# EAGLE design SMD RGB COM AO3402 REV1 (EAGLE 8.5.1)
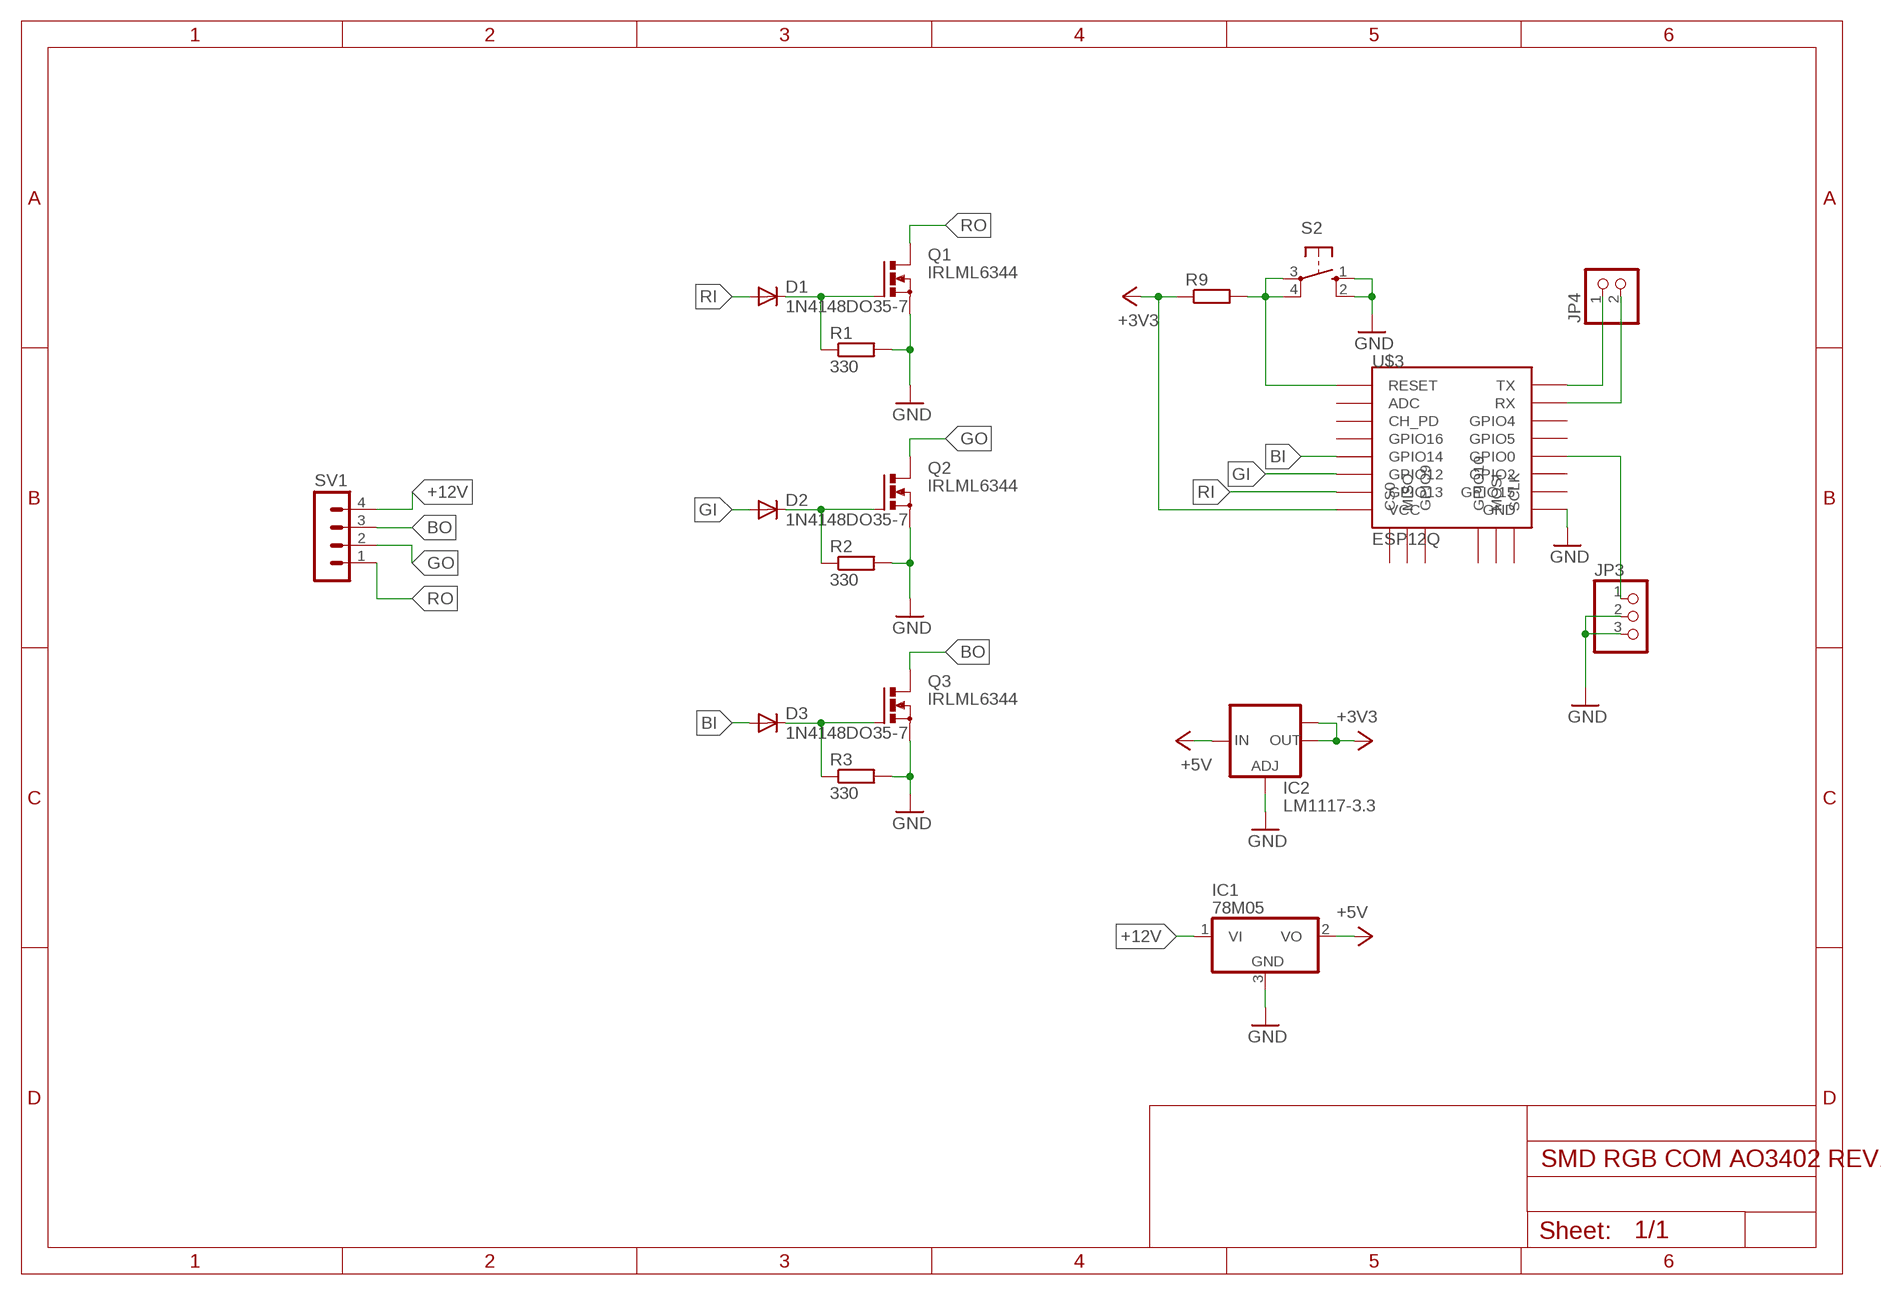
[diagram p0: schematic, sheet 1]

## Parts
D1  1N4148DO35-7  [DO35-7]
D2  1N4148DO35-7  [DO35-7]
D3  1N4148DO35-7  [DO35-7]
IC1  78M05  7805DT  [TO252]
IC2  LM1117-3.3  LM1117IMPX-ADJ  [SOT223]
JP3  PINHD-1X3  [1X03]
JP4  PINHD-1X2  [1X02]
Q1  IRLML6344  [SOT-23]
Q2  IRLML6344  [SOT-23]
Q3  IRLML6344  [SOT-23]
R1  330  R-EU_0204/7  [0204/7]
R2  330  R-EU_0204/7  [0204/7]
R3  330  R-EU_0204/7  [0204/7]
R9  R-EU_0204/7  [0204/7]
S2  10-XX  [B3F-10XX]
SV1  MA04-1  [MA04-1]
U$3  ESP12Q  [ESP12Q]

## Nets
+3V3: IC2.2(OUT) IC2.TAB(OUT1) R9.1 U$3.VCC
+5V [+V]: IC1.2(VO) IC2.3(IN)
+12V: IC1.1(VI) SV1.4
BB: D3.C Q3.P1(G) R3.1
BG: D2.C Q2.P1(G) R2.1
BI: D3.A U$3.GPIO14
BO [+V]: Q3.P3(D) SV1.3
BR: D1.C Q1.P1(G) R1.1
GI: D2.A U$3.GPIO12
GND [GND]: IC1.3(GND) IC2.1(ADJ) JP3.2 JP3.3 Q1.P2(S) Q2.P2(S) Q3.P2(S) R1.2 R2.2 R3.2 S2.1(S) S2.2(S1) U$3.GND
GO [+V]: Q2.P3(D) SV1.2
N$8: R9.2 S2.3(P) S2.4(P1) U$3.RESET
N$12: JP3.1 U$3.GPIO0
N$13: JP4.1 U$3.TX
N$14: JP4.2 U$3.RX
RI: D1.A U$3.GPIO13
RO [+V]: Q1.P3(D) SV1.1
Unconnected: U$3.ADC U$3.CH_PD U$3.CS0 U$3.GPIO2 U$3.GPIO4 U$3.GPIO5 U$3.GPIO9 U$3.GPIO10 U$3.GPIO15 U$3.GPIO16 U$3.MISO U$3.MOSI U$3.SCLK

## Library data of the parts
D1-D3 = diode:1N4148: DIODE high speed (Philips)
IC1 = linear:78*: Positive VOLTAGE REGULATOR Source: http://cache.national.com/ds/LM/LM78L05.pdf http://www.fairchildsemi.com/ds/LM/LM7805.pdf
IC2 = lm1117:LM1117IMPX-ADJ
JP3 = pinhead:PINHD-1X3: PIN HEADER
JP4 = pinhead:PINHD-1X2: PIN HEADER
Q1-Q3 = mosfet:IRLML6344: Nch MOSFET IRLML6344 30V 5A http://akizukidenshi.com/catalog/g/gI-06049/ I-06049
R1-R3 R9 = rcl:R-EU_: RESISTOR, European symbol; SPICEPREFIX: R
S2 = switch-omron:10-XX: OMRON SWITCH; MPN: B3F-1000; OC_FARNELL: 176432; OC_NEWARK: 36M3542
SV1 = con-lstb:MA04-1: PIN HEADER; OC_FARNELL: unknown; OC_NEWARK: unknown
U$3 = esp826612q:ESP12Q: ESP8266 Wifi module 12-Q

## Net classes
0 SIGNAL: width 0.61 mm, clearance 0.381 mm
1 GND: width 1.016 mm, clearance 0.254 mm
2 +V: width 1.016 mm, clearance 0.381 mm

## Board
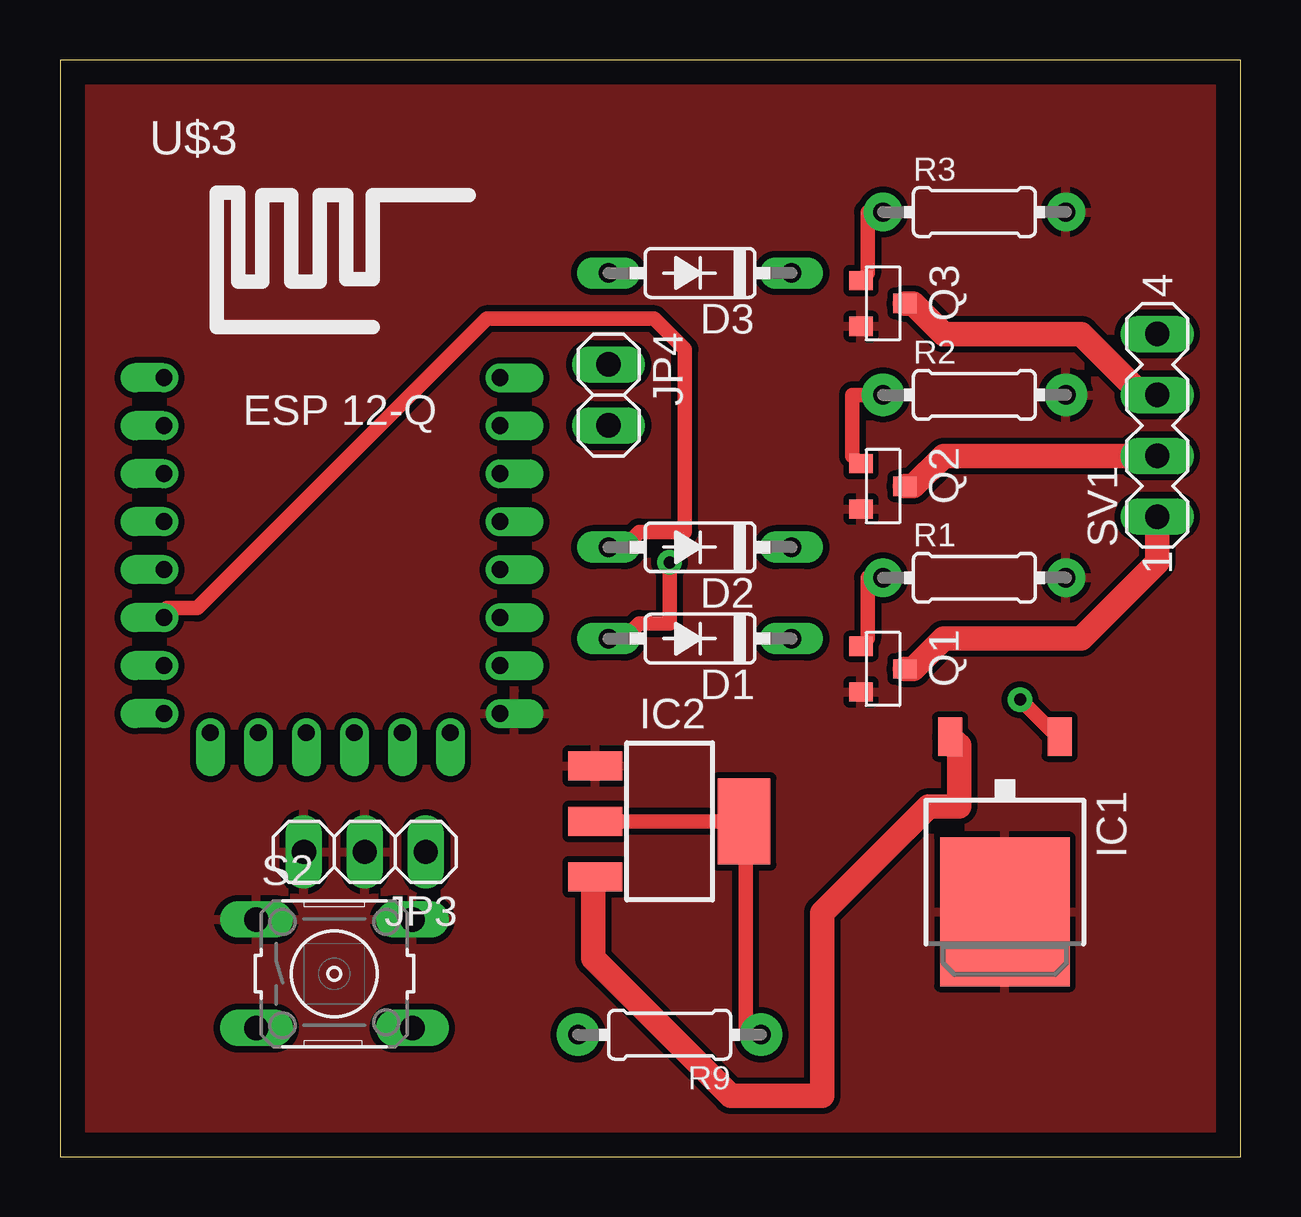
[diagram p1: board, top side]
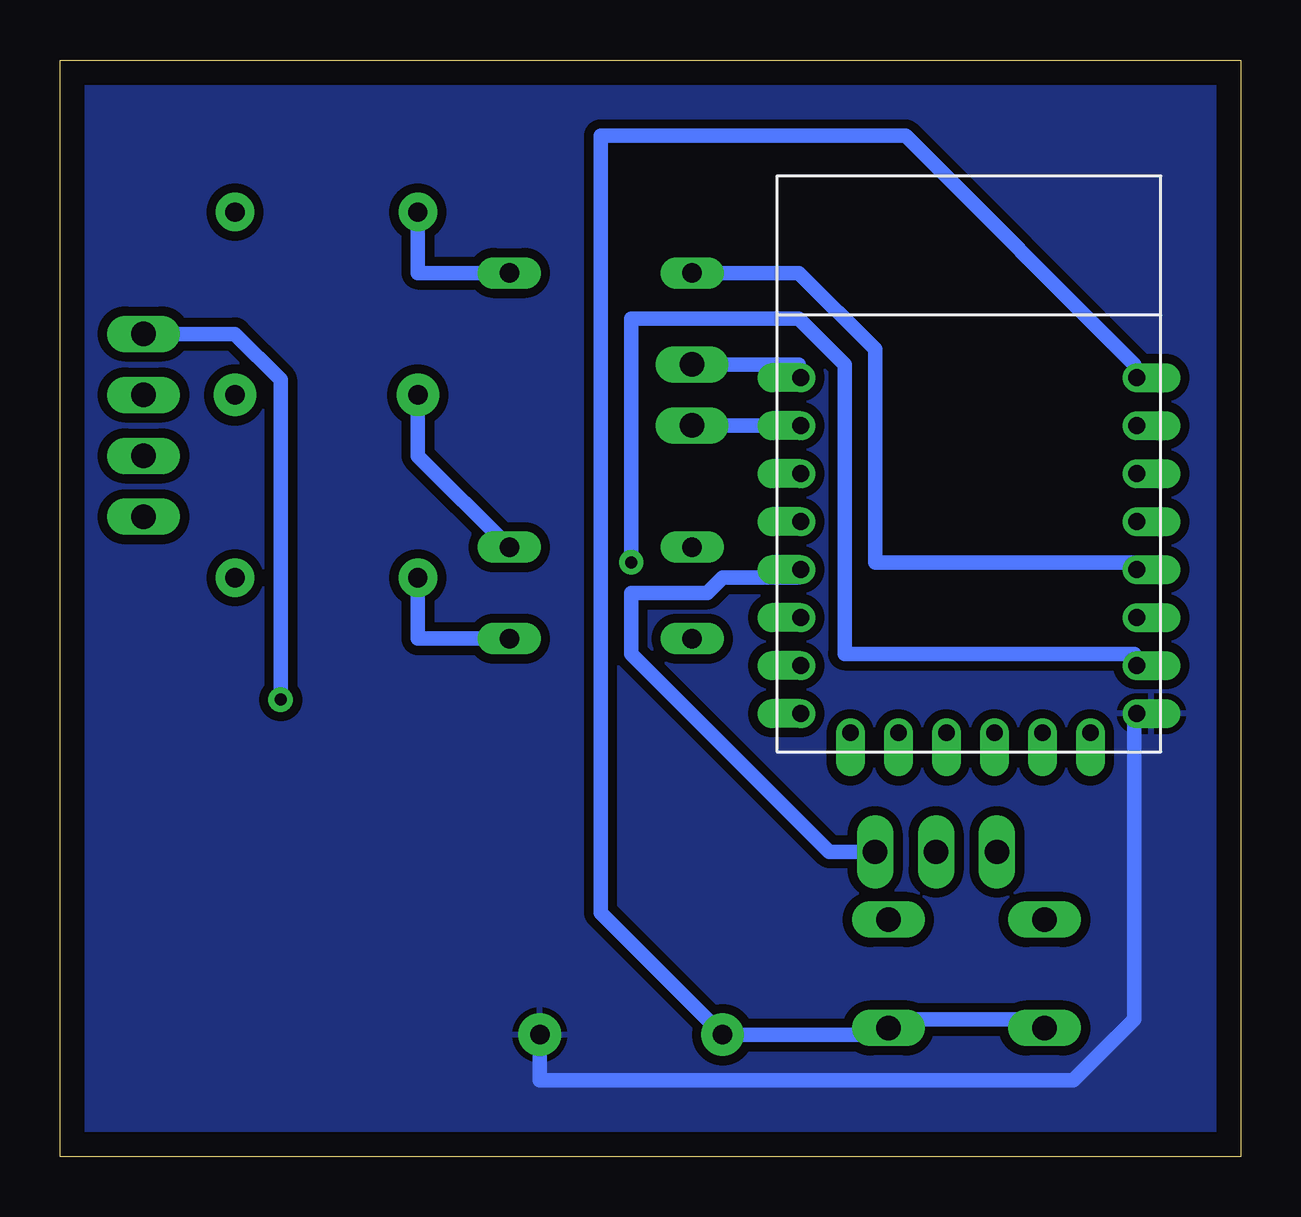
[diagram p2: board, bottom side, seen from below]

Size 49.2 x 45.71 mm. Coordinates in mm from the lower left corner, seen from the top.
Outline: 0,0 49.2,0 49.2,45.71 0,45.71 0,0
Copper layers (1*16): Top 0.035mm / dielectric 1.5mm / Bottom 0.035mm
Design rules "default": minimum track width 6mil, minimum drill 0.35mm, track to track 6mil, track to pad 6mil, pad to pad 6mil, via to via 6mil, smd to smd 6mil, copper to edge 40mil, drill to drill 6mil, minimum pad ring 10mil, minimum via ring 8mil, stop-mask expansion 4mil, vias tented up to drill 0mil, thermal gap 10mil

### Footprints (pad centres in the part's own frame; a part is rotated, then mirrored left to right if it is on the bottom)
DO35-7 = drill 0.813 long: A 3.81,0; C -3.81,0
TO252 = smd 1 x 1.6: 1 -2.28,-4.8; 2 2.28,-4.8 | smd 5.4 x 6.2: 3 0,2.5
SOT223 = smd 1.219 x 2.235: 1 -2.311,-3.099; 2 0,-3.099; 3 2.311,-3.099 | smd 3.6 x 2.2: TAB 0,3.099
1X03 = drill 1.016 long: 1 -2.54,0; 2 0,0; 3 2.54,0
1X02 = drill 1.016 long: 1 -1.27,0; 2 1.27,0
SOT-23 = smd 0.802 x 0.972: P1 -0.95,-0.917; P2 0.95,-0.917; P3 0,0.917
0204/7 = drill 0.8 pad 1.6: 1 -3.81,0; 2 3.81,0
0204/7' = drill 0.813 pad 1.778: 1 -3.81,0; 2 3.81,0
B3F-10XX = drill 1.016 long: 1 -3.251,2.261; 2 3.251,2.261; 3 -3.251,-2.261; 4 3.251,-2.261
MA04-1 = drill 1.016 long: 1 -3.81,0; 2 -1.27,0; 3 1.27,0; 4 3.81,0
ESP12Q = drill 0.7 offset: ADC -7.1,3.8; CH_PD -7.1,1.8; CS0 -5.165,-9.005; GND 6.9,-8.2; GPIO0 6.9,-2.2; GPIO2 6.9,-4.2; GPIO4 6.9,1.8; GPIO5 6.9,-0.2; GPIO9 -1.165,-9.005; GPIO10 0.835,-9.005; GPIO12 -7.1,-4.2; GPIO13 -7.1,-6.2; GPIO14 -7.1,-2.2; GPIO15 6.9,-6.2; GPIO16 -7.1,-0.2; MISO -3.165,-9.005; MOSI 2.835,-9.005; RESET -7.1,5.8; RX 6.9,3.8; SCLK 4.835,-9.005; TX 6.9,5.8; VCC -7.1,-8.2

### Placement (x,y rotation side)
D1  26.67,21.59 180 top
D2  26.67,25.4 180 top
D3  26.67,36.83 180 top
IC1  39.37,12.7 180 top
IC2  25.4,13.97 270 top
JP3  12.7,12.7 180 top
JP4  22.86,31.75 270 top
Q1  34.29,20.32 270 top
Q2  34.29,27.94 270 top
Q3  34.29,35.56 270 top
R1  38.1,24.13 0 top
R2  330  [0204/7']  38.1,31.75 0 top
R3  38.1,39.37 0 top
R9  [0204/7']  25.4,5.08 180 top
S2  11.43,7.62 0 top
SV1  45.72,30.48 90 top
U$3  11.43,26.67 0 top

### Tracks (layer width: path | path; a pad name or v marks a point on that pad's centre or on a via)
+3V3
  Top 0.61: IC2.2 IC2.TAB 28.57,13.97 28.57,5.08 R9.1
  Bottom 0.61: R9.1 29.21,3.17 6.99,3.17 4.45,5.71 4.45,18.41 U$3.VCC
  pour Bottom: -1.27,46.99 49.53,46.99 49.53,-1.27 -1.27,-1.27
+5V
  Top 1.016: IC1.2 37.47,17.14 37.47,14.61 36.2,14.61 31.75,10.16 31.75,2.54 27.94,2.54 22.23,8.26 22.23,11.43 IC2.3
+12V  (via drill 0.51 pad 1.02)
  Top 0.61: v40.01,19.05 41.27,17.78 IC1.1
  Bottom 0.61: v40.01,19.05 40.01,32.38 41.91,34.29 SV1.4
BB
  Top 0.61: R3.1 33.66,39.37 33.66,36.83 Q3.P1
  Bottom 0.61: D3.C 34.29,36.83 R3.1
BG
  Top 0.61: R2.1 33.02,31.75 33.02,29.21 Q2.P1
  Bottom 0.61: D2.C 34.29,29.21 R2.1
BI
  Bottom 0.61: D3.A 18.41,36.83 15.24,33.66 15.24,24.77 4.45,24.77 U$3.GPIO14
BO
  Top 1.016: SV1.3 45.09,31.75 42.55,34.29 36.83,34.29 35.56,35.56 Q3.P3
BR
  Top 0.61: R1.1 33.66,24.13 33.66,21.59 Q1.P1
  Bottom 0.61: D1.C 34.29,21.59 R1.1
GI
  Top 0.61: D2.A 23.5,25.4 24.13,26.04 26.04,26.04 26.04,33.66 24.77,34.92 17.78,34.92 5.71,22.86 4.45,22.86 U$3.GPIO12
GND
  pour Top: 0,45.72 49.53,45.72 49.53,0 0,0
GO
  Top 1.016: SV1.2 36.83,29.21 35.56,27.94 Q2.P3
N$8
  Bottom 0.61: S2.3 8.26,5.71 14.61,5.71 S2.4 15.24,5.08 R9.2 26.67,10.16 26.67,42.55 13.97,42.55 4.45,33.02 U$3.RESET
N$12
  Bottom 0.61: JP3.1 17.14,12.7 25.4,20.95 25.4,23.5 22.23,23.5 21.59,24.13 18.41,24.13 U$3.GPIO0
N$13
  Bottom 0.61: JP4.1 18.41,33.02 U$3.TX
N$14
  Bottom 0.61: JP4.2 18.41,30.48 U$3.RX
RI  (via drill 0.51 pad 1.02)
  Top 0.61: v25.4,24.77 25.4,22.23 24.13,22.23 23.5,21.59 D1.A
  Bottom 0.61: v25.4,24.77 25.4,34.92 18.41,34.92 16.51,33.02 16.51,20.95 4.45,20.95 U$3.GPIO13
RO
  Top 1.016: SV1.1 45.72,24.77 42.55,21.59 36.83,21.59 35.56,20.32 Q1.P3